# EasyEDA Pro project 【嘉立创】SguanFOC_MOTOR.epro, schematic Schematic1
Board Name: Board1; Create Date: 2026-03-16; Page Name: 电控板; Project Name: ZH-电控板CH32V2(v2.0); Schematic Name: Schematic1; Update Date: 2026-04-14; Company: 星必尘Sguan; Page Size: A3; Version: V1.0
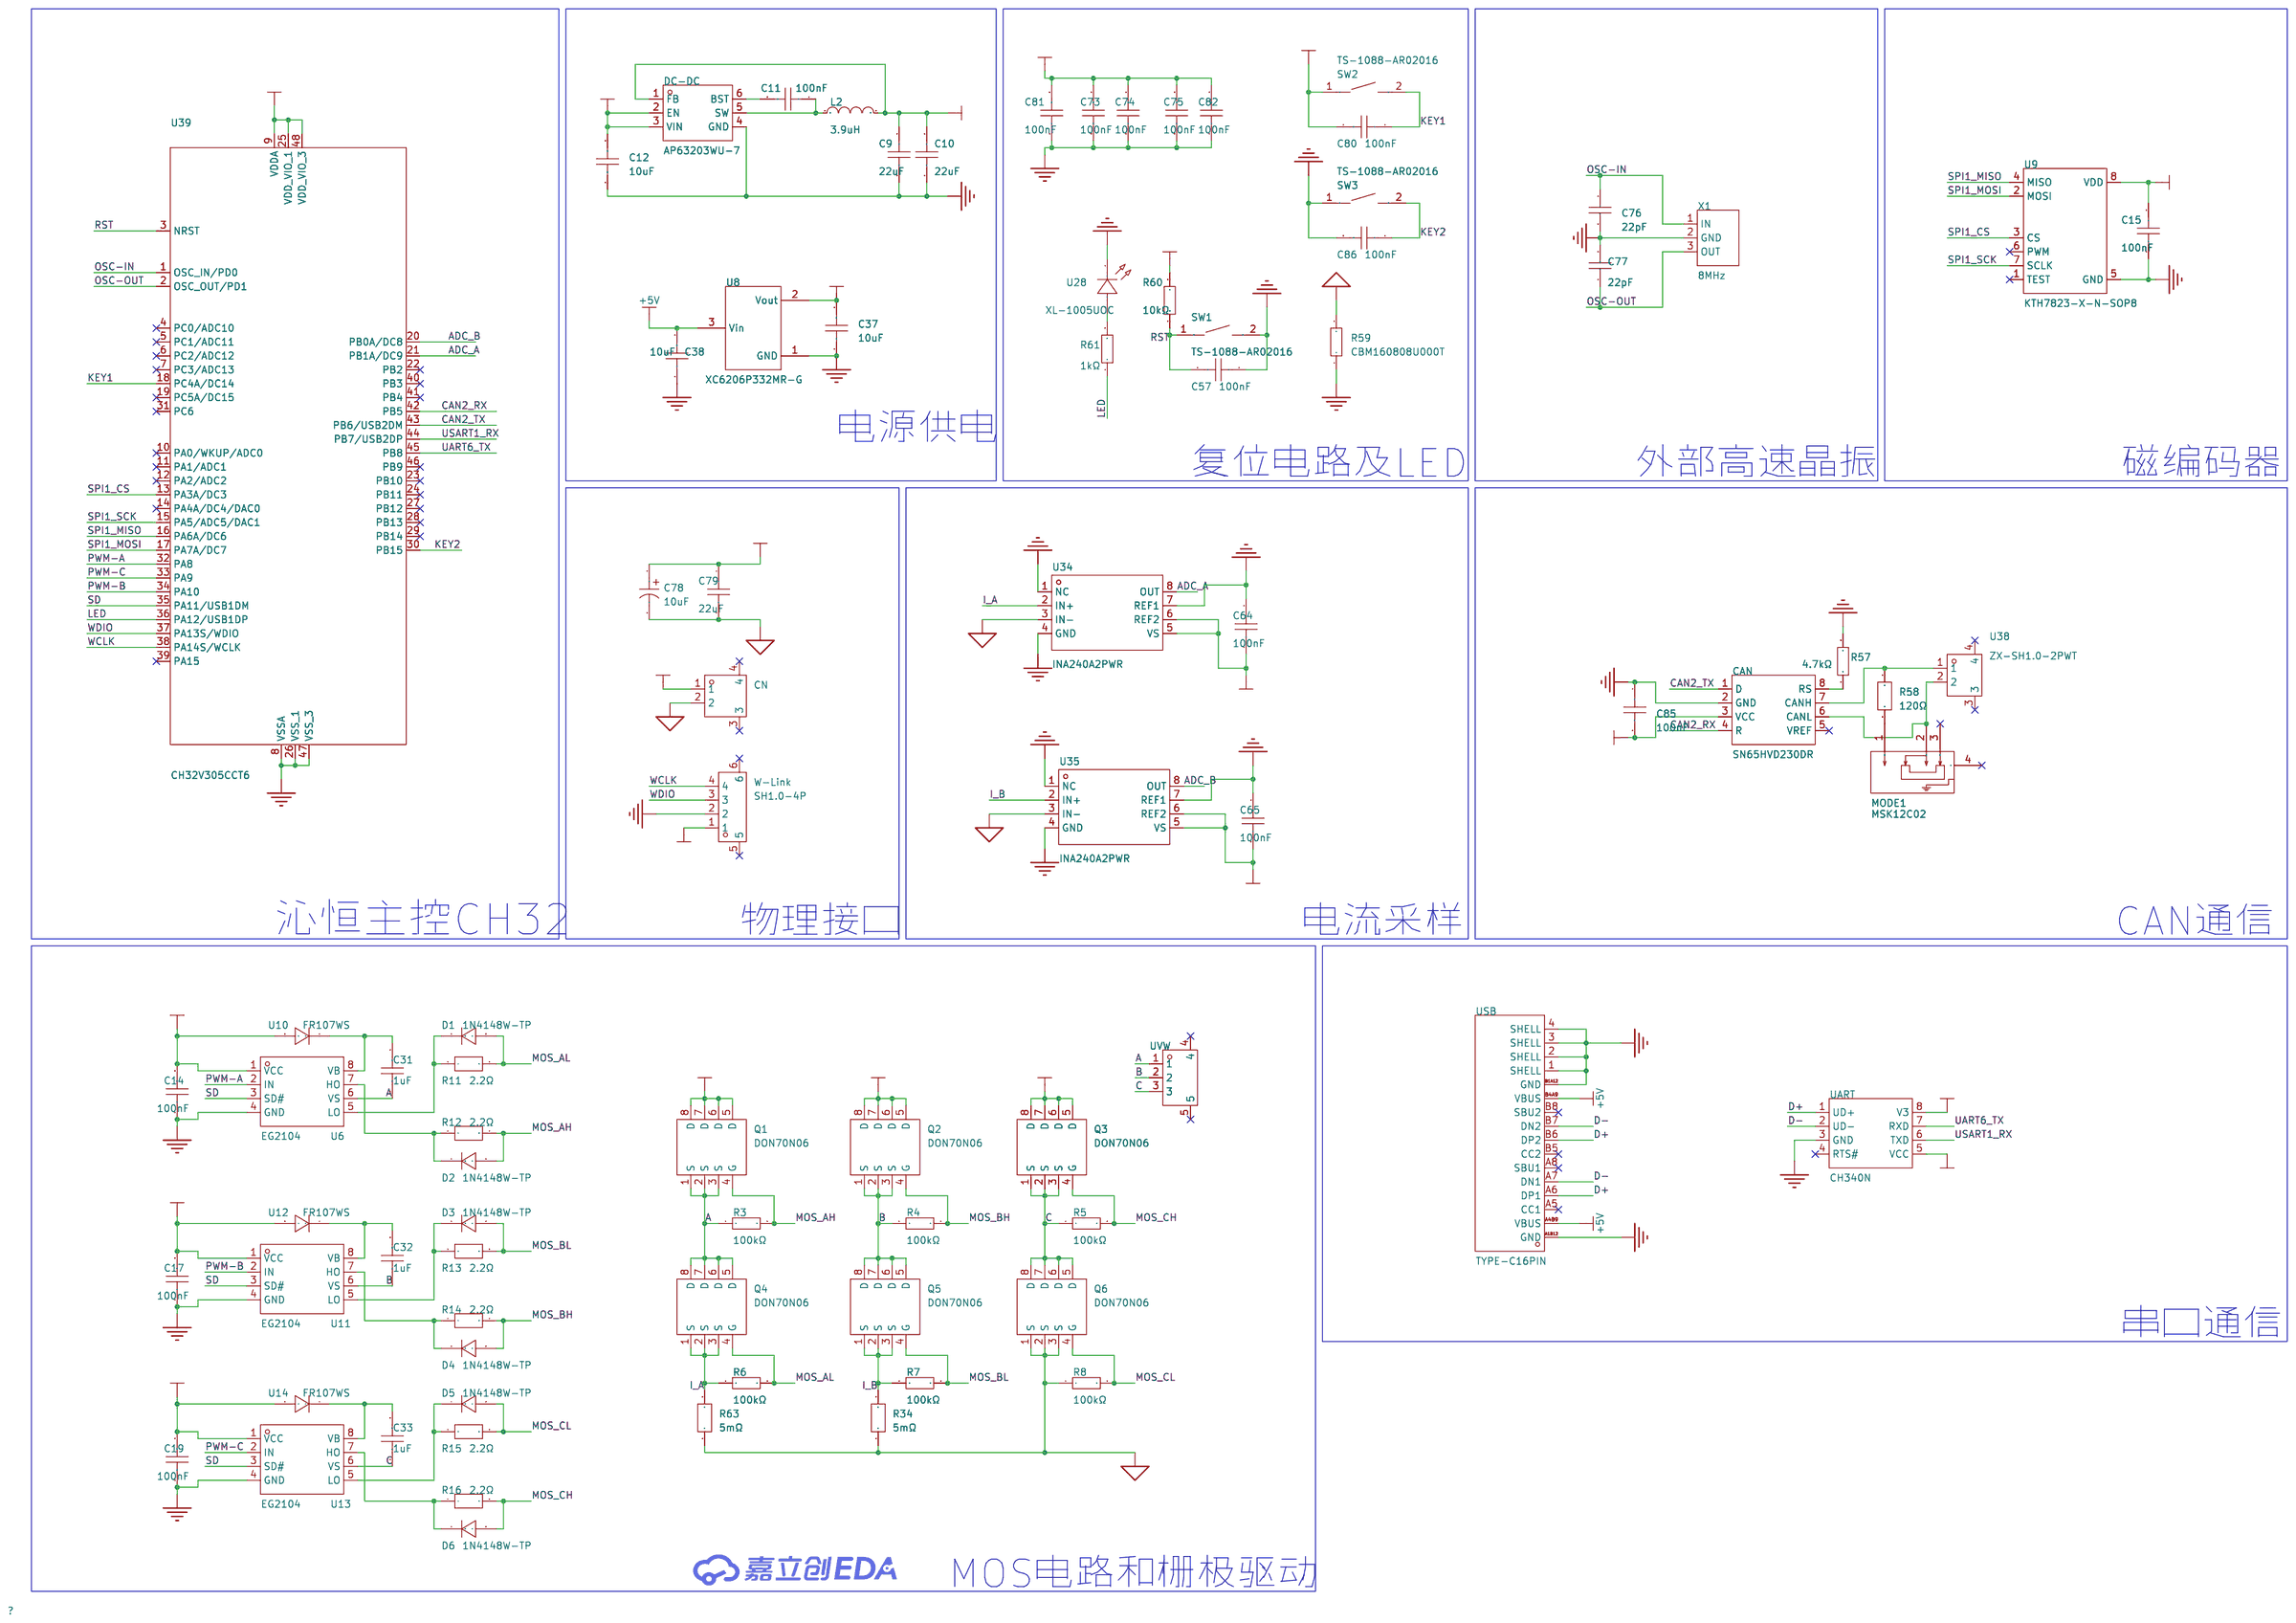
[diagram p0: schematic sheet]

## Parts
C9  22uF  [C0603]
C10  22uF  [C0603]
C11  100nF  [C0603]
C12  10uF  [C0603]
C14  100nF  [C0603]
C15  100nF  [C0603]
C17  100nF  [C0603]
C19  100nF  [C0603]
C31  1uF  [C0603]
C32  1uF  [C0603]
C33  1uF  [C0603]
C37  10uF  [C0603]
C38  10uF  [C0603]
C57  100nF  [C0603]
C64  100nF  [C0603]
C65  100nF  [C0603]
C73  100nF  [C0603]
C74  100nF  [C0603]
C75  100nF  [C0603]
C76  22pF  [C0603]
C77  22pF  [C0603]
C78  10uF  [CAP-SMD_BD4.0-L4.3-W4.3-LS5.0-FD]
C79  22uF  [C0603]
C80  100nF  [C0603]
C81  100nF  [C0603]
C82  100nF  [C0603]
C85  100nF  [C0603]
C86  100nF  [C0603]
CAN  SN65HVD230DR  [SOIC-8_L4.9-W3.9-P1.27-LS6.0-BL]
CN  XT30PW-M  [CONN-TH_XT30PW-M]
D1  1N4148W-TP  [SOD-123_L2.8-W1.8-LS3.7-RD]
D2  1N4148W-TP  [SOD-123_L2.8-W1.8-LS3.7-RD]
D3  1N4148W-TP  [SOD-123_L2.8-W1.8-LS3.7-RD]
D4  1N4148W-TP  [SOD-123_L2.8-W1.8-LS3.7-RD]
D5  1N4148W-TP  [SOD-123_L2.8-W1.8-LS3.7-RD]
D6  1N4148W-TP  [SOD-123_L2.8-W1.8-LS3.7-RD]
DC-DC  AP63203WU-7  [TSOT-26_L2.9-W1.6-P0.95-LS2.8-BL]
L2  3.9uH  [IND-SMD_L3.0-W3.0_FNR30XXS]
MODE1  MSK12C02  [SW-TH_MSK12C02]
Q1  DON70N06  [DFN-8_L5.8-W4.9-P1.27-LS6.1-BL-2]
Q2  DON70N06  [DFN-8_L5.8-W4.9-P1.27-LS6.1-BL-2]
Q3  DON70N06  [DFN-8_L5.8-W4.9-P1.27-LS6.1-BL-2]
Q4  DON70N06  [DFN-8_L5.8-W4.9-P1.27-LS6.1-BL-2]
Q5  DON70N06  [DFN-8_L5.8-W4.9-P1.27-LS6.1-BL-2]
Q6  DON70N06  [DFN-8_L5.8-W4.9-P1.27-LS6.1-BL-2]
R3  100kΩ  [R0603]
R4  100kΩ  [R0603]
R5  100kΩ  [R0603]
R6  100kΩ  [R0603]
R7  100kΩ  [R0603]
R8  100kΩ  [R0603]
R11  2.2Ω  [R1206]
R12  2.2Ω  [R1206]
R13  2.2Ω  [R1206]
R14  2.2Ω  [R1206]
R15  2.2Ω  [R1206]
R16  2.2Ω  [R1206]
R34  5mΩ  [R2512]
R57  4.7kΩ  [R0603]
R58  120Ω  [R0603]
R59  CBM160808U000T  [L0603]
R60  10kΩ  [R0603]
R61  1kΩ  [R0603]
R63  5mΩ  [R2512]
SW1  TS-1088-AR02016  [SW-SMD_L3.9-W3.0-P4.45]
SW2  TS-1088-AR02016  [SW-SMD_L3.9-W3.0-P4.45]
SW3  TS-1088-AR02016  [SW-SMD_L3.9-W3.0-P4.45]
U6  EG2104  [SOP-8_L5.0-W4.0-P1.27-LS6.2-BL]
U8  XC6206P332MR-G  [SOT-23-3_L2.9-W1.6-P1.90-LS2.8-BR]
U9  KTH7823-X-N-SOP8  [SOP-8_L4.9-W3.9-P1.27-LS6.0-BL]
U10  FR107WS  [SOD-323_L1.6-W1.3-LS2.7-RD]
U11  EG2104  [SOP-8_L5.0-W4.0-P1.27-LS6.2-BL]
U12  FR107WS  [SOD-323_L1.6-W1.3-LS2.7-RD]
U13  EG2104  [SOP-8_L5.0-W4.0-P1.27-LS6.2-BL]
U14  FR107WS  [SOD-323_L1.6-W1.3-LS2.7-RD]
U28  XL-1005UOC  [LED0402-RD_ORANGE]
U34  INA240A2PWR  [TSSOP-8_L4.4-W3.0-P0.65-LS6.4-BL]
U35  INA240A2PWR  [TSSOP-8_L4.4-W3.0-P0.65-LS6.4-BL]
U38  ZX-SH1.0-2PWT  [CONN-SMD_2P-P1.00_HX-1.0-2P-WT]
U39  CH32V305CCT6  [LQFP-48_L7.0-W7.0-P0.50-LS9.0-BL_1]
UART  CH340N  [SOP-8_L4.9-W3.9-P1.27-LS6.0-BL]
USB  TYPE-C16PIN  [USB-C-SMD_TYPE-C16PIN]
UVW  MR30PW-F  [CONN-TH_MR30PW-F]
W-Link  SH1.0-4P  [CONN-SMD_4P-P1.00_SH1.0-4P]
X1  8MHz  [OSC-SMD_3P-L3.2-W1.3-P1.20]

## Library data of the parts
C9 C10 C79 = CGA0603X5R226M100JT: 容值:22uF;精度:±20%;额定电压:10V;温度系数:X5R;; LCSC Part Name: 22uF ±20% 10V; Supplier Part: C6119863; Manufacturer: HRE(芯声); Supplier Footprint: 0603; Datasheet: https://item.szlcsc.com/datasheet/CGA0603X5R226M100JT/7062569.html; Supplier: LCSC; Tolerance: ±20%; Voltage Rating: 10V; Temperature Coefficient: X5R
C11 C14 C15 C17 C19 C57 C64 C65 C73-C75 C80-C82 C85 C86 = CGA0603X7R104K500JT: 容值:100nF;精度:±10%;额定电压:50V;温度系数:X7R;; LCSC Part Name: 100nF ±10% 50V; Supplier Part: C6119867; Manufacturer: HRE(芯声); Supplier Footprint: 0603; Datasheet: https://atta.szlcsc.com/upload/public/pdf/source/20250103/C44077DA9E7B3EFAE02F22B6D3D1CBC9.pdf; Supplier: LCSC; Tolerance: ±10%; Voltage Rating: 50V; Temperature Coefficient: X7R
C12 = CGA0603X5R106K100JT: 容值:10uF;精度:±10%;额定电压:10V;温度系数:X5R;; LCSC Part Name: 10uF ±10% 10V; Supplier Part: C6119842; Manufacturer: HRE(芯声); Supplier Footprint: 0603; Supplier: LCSC; Tolerance: ±10%; Voltage Rating: 10V; Temperature Coefficient: X5R
C31-C33 = CGA0603X5R105K500JT: 容值:1uF;精度:±10%;额定电压:50V;温度系数:X5R;; LCSC Part Name: 1uF ±10% 50V; Supplier Part: C6119852; Manufacturer: HRE(芯声); Supplier Footprint: 0603; Supplier: LCSC; Tolerance: ±10%; Voltage Rating: 50V; Temperature Coefficient: X5R
C37 C38 = CAP_0603: Supplier Footprint: 0603
C76 C77 = CL10C220JB8NNNC: 容值:22pF;精度:±5%;额定电压:50V;温度系数:C0G;; LCSC Part Name: 22pF ±5% 50V; Supplier Part: C1653; Manufacturer: SAMSUNG(三星); Supplier Footprint: 0603; JLCPCB Part Class: 基础库; Datasheet: https://item.szlcsc.com/datasheet/CL10C220JB8NNNC/2005.html; Supplier: LCSC; Tolerance: ±5%; Voltage Rating: 50V; Temperature Coefficient: C0G
C78 = RVT16V10M4X5: 容值:10uF;精度:±20%;额定电压:16V;纹波电流:17mA@120Hz;等效串联电阻(ESR):-;; LCSC Part Name: 10uF ±20% 16V; Supplier Part: C47023101; Manufacturer: JIERR(捷而瑞); Supplier Footprint: SMD,D4xL5.4mm; JLCPCB Part Class: Extended Part; Datasheet: https://item.szlcsc.com/datasheet/RVT16V10M4X5/49206202.html; Supplier: LCSC; Tolerance: ±20%; Voltage Rating: 16V; Ripple Current: 17mA@120Hz; Diameter: 4mm; Height - Seated (Max): 5.4mm; Lifetime: 2000hrs@105℃; Operating Temperature: -40℃~+105℃
CAN = SN65HVD230DR: 类型:CAN收发器;数据速率:1Mbps;; LCSC Part Name: 3.3-V CAN 收发器; Supplier Part: C12084; Manufacturer: TI(德州仪器); Supplier Footprint: SOIC-8; JLCPCB Part Class: 扩展库; Datasheet: https://www.ti.com/cn/lit/gpn/sn65hvd230; Supplier: LCSC; Type: CAN收发器; Data Rate: 1Mbps; Operating Temperature: -40℃~+85℃
CN = XT30PW-M: Socket,DCsupply,XT30,male,PIN:2; LCSC Part Name: AMASS(艾迈斯)航模插头 卧式弯脚 XT30PW-M公头; Supplier Part: C431092; Manufacturer: AMASS(艾迈斯); JLCPCB Part Class: 扩展库; Datasheet: https://atta.szlcsc.com/upload/public/pdf/source/20220222/6A9F22F7850E25B33E1BE430ADF8560B.pdf; Supplier: LCSC
D1-D6 = 1N4148W-TP: 二极管配置:-;正向压降(Vf):1.25V@150mA;直流反向耐压(Vr):100V;整流电流:150mA;反向恢复时间(Trr):4ns;; Supplier Part: C77978; Manufacturer: MCC(美微科); Supplier Footprint: SOD-123; JLCPCB Part Class: 扩展库; Datasheet: https://item.szlcsc.com/datasheet/1N4148W-TP/79112.html; Supplier: LCSC; Voltage - Forward(Vf@If): 1.25V@150mA; Voltage - DC Reverse(Vr): 100V; Current - Rectified: 150mA; Pd - Power Dissipation: 400mW; Reverse Leakage Current (Ir): 1uA@75V; Reverse Recovery Time (trr): 4ns; Operating Junction Temperature Range: -65℃~+150℃@(Tj); Non-Repetitive Peak Forward Surge Current: 2A
DC-DC = AP63203WU-7: 功能类型:降压型;工作电压:3.8V~32V;输出电压:3.3V;输出电流:2A;输出类型:固定;; LCSC Part Name: 3.8V至32V输入、2A低静态电流同步降压转换器，增强EMI抑制; Supplier Part: C780769; Manufacturer: DIODES(美台); Supplier Footprint: TSOT-23-6; JLCPCB Part Class: 扩展库; Datasheet: https://item.szlcsc.com/datasheet/AP63203WU-7/832852.html; Supplier: LCSC; Function: 降压型; Voltage - Supply: 3.8V~32V; Output Voltage: 3.3V; Output Current: 2A; Frequency - Switching: 1.1MHz; Operating Temperature: -40℃~+85℃@(TA); Synchronous Rectifier: 是; Number of Outputs: 1; Topology: 降压式; Quiescent Current: 22uA; Switch tube (built-in/external): 内置; Output Type: 固定
L2 = FNR3015S3R9MT: 电感值:3.9uH;精度:±20%;额定电流:1.5A;饱和电流(Isat):1.4A;类型:磁胶屏蔽绕线合金电感;; LCSC Part Name: 3.9uH ±20% 1.4A; Supplier Part: C167751; Manufacturer: cjiang(长江微电); Supplier Footprint: SMD,3x3mm; JLCPCB Part Class: 扩展库; Datasheet: https://atta.szlcsc.com/upload/public/pdf/source/20190327/C167925_9EFF0AABC4CA629C2CC95961DBF7D39D.pdf; Supplier: LCSC; Tolerance: ±20%; Current Rating: 1.5A; Current - Saturation(Isat): 1.4A; DC Resistance(DCR): 137mΩ; Type: 磁胶屏蔽绕线合金电感
MODE1 = MSK12C02: 电路结构:单刀双掷;安装方式:卧贴;开关颜色:-;额定电流(DC):50mA;额定电压(DC):12V;额定电流(AC):-;额定电压(AC):-;机械寿命:1万次;; LCSC Part Name: 两档侧拨贴片 7脚 滑动开关; Supplier Part: C431540; Manufacturer: SHOU HAN(首韩); Supplier Footprint: SMD; Datasheet: https://atta.szlcsc.com/upload/public/pdf/source/20190925/C431540_89155AEF0758B9AD1B2D805F83FB12E3.pdf; Supplier: LCSC; Circuit: 单刀双掷; Pin Style: SMD接片; Switch Length: 8mm; Switch Width: 2.8mm; Switch Height: 1.4mm; Mounting Style: 卧贴; Current Rating (DC): 50mA; Voltage Rating (DC): 12V; Mechanical Life: 1万次; Operating Temperature: -20℃~+70℃
Q1-Q6 = DON70N06: 数量:1个N沟道;漏源电压(Vdss):60V;连续漏极电流(Id):70A;导通电阻(RDS(on)):6mΩ@10V;耗散功率(Pd):87W;阈值电压(Vgs(th)):2.5V@250uA;; Supplier Part: C41384263; Manufacturer: DOINGTER(杜因特); Supplier Footprint: DFN5x6-8; JLCPCB Part Class: 扩展库; Datasheet: https://item.szlcsc.com/datasheet/DON70N06/43175967.html; Supplier: LCSC; Number: 1个N沟道; Drain to Source Voltage: 60V; Current - Continuous Drain(Id): 70A; RDS(on): 6mΩ@10V; Pd - Power Dissipation: 87W; Gate Threshold Voltage (Vgs(th)): 2.5V@250uA; Gate Charge(Qg): 30nC@10V; Input Capacitance(Ciss): 2.136nF@50V; Reverse Transfer Capacitance (Crss@Vds): 10.6pF@50V; Operating Temperature: -55℃~+150℃; Type: N沟道
R3-R8 = 0603WAF1003T5E: 电阻类型:厚膜电阻;阻值:100kΩ;精度:±1%;功率:100mW;工作电压:75V;温度系数:±100ppm/℃;; LCSC Part Name: 100kΩ ±1% 100mW 厚膜电阻; Supplier Part: C25803; Manufacturer: UNI-ROYAL(厚声); Supplier Footprint: 0603; JLCPCB Part Class: 基础库; Datasheet: https://item.szlcsc.com/datasheet/0603WAF1003T5E/26546.html; Supplier: LCSC; Type: 厚膜电阻; Tolerance: ±1%; Power(Watts): 100mW; Voltage-Supply(Max): 75V; Temperature Coefficient: ±100ppm/℃; Operating Temperature: -55℃~+155℃
R11-R16 = FRC1206J2R2 TS: 电阻类型:厚膜电阻;阻值:2.2Ω;精度:±5%;功率:250mW;工作电压:200V;温度系数:±200ppm/℃;; LCSC Part Name: 2.2Ω ±5% 250mW 厚膜电阻; Supplier Part: C2907445; Manufacturer: FOJAN(富捷); Supplier Footprint: 1206; JLCPCB Part Class: 扩展库; Supplier: LCSC; Type: 厚膜电阻; Tolerance: ±5%; Power(Watts): 250mW; Voltage-Supply(Max): 200V; Temperature Coefficient: ±200ppm/℃; Operating Temperature: -55℃~+155℃
R34 R63 = JER2512F3R005: 电阻类型:采样电阻；合金电阻;阻值:5mΩ;精度:±1%;功率:3W;温度系数:±50ppm/℃;; LCSC Part Name: 5mΩ 3W 2512 ±1%; Supplier Part: C46634460; Manufacturer: JIERR(捷而瑞); Supplier Footprint: 2512; JLCPCB Part Class: 扩展库; Datasheet: https://item.szlcsc.com/datasheet/JER2512F3R005/48788262.html; Supplier: LCSC; Type: 采样电阻；合金电阻; Tolerance: ±1%; Power(Watts): 3W; Temperature Coefficient: ±50ppm/℃
R57 = 0603WAF4701T5E: 电阻类型:厚膜电阻;阻值:4.7kΩ;精度:±1%;功率:100mW;工作电压:75V;温度系数:±100ppm/℃;; LCSC Part Name: 4.7kΩ ±1% 100mW 厚膜电阻; Supplier Part: C23162; Manufacturer: UNI-ROYAL(厚声); Supplier Footprint: 0603; Datasheet: https://item.szlcsc.com/datasheet/0603WAF4701T5E/23889.html; Supplier: LCSC; Type: 厚膜电阻; Tolerance: ±1%; Power(Watts): 100mW; Voltage-Supply(Max): 75V; Temperature Coefficient: ±100ppm/℃; Operating Temperature: -55℃~+155℃
R58 = FRC0603J121 TS: 电阻类型:厚膜电阻;阻值:120Ω;精度:±5%;功率:100mW;工作电压:75V;温度系数:±100ppm/℃;; LCSC Part Name: 120Ω ±5% 100mW 厚膜电阻; Supplier Part: C2907096; Manufacturer: FOJAN(富捷); Supplier Footprint: 0603; JLCPCB Part Class: 扩展库; Supplier: LCSC; Type: 厚膜电阻; Tolerance: ±5%; Power(Watts): 100mW; Voltage-Supply(Max): 75V; Temperature Coefficient: ±100ppm/℃; Operating Temperature: -55℃~+155℃
R59 = CBM160808U000T: 阻抗@频率:0Ω@100MHz;直流电阻(DCR):10mΩ;; LCSC Part Name: 单路 0603磁珠 阻抗0Ω@100MHz; Supplier Part: C394410; Manufacturer: FH(风华); Supplier Footprint: 0603; JLCPCB Part Class: Extended Part; Datasheet: https://item.szlcsc.com/datasheet/CBM160808U000T/373685.html; Supplier: LCSC; Impedance @ Frequency: 0Ω@100MHz; DC Resistance(DCR): 10mΩ; Current Rating: 6A; Number of Circuits: 1; Operating Temperature: -55℃~+125℃
R60 = 0603WAF1002T5E: 电阻类型:厚膜电阻;阻值:10kΩ;精度:±1%;功率:100mW;工作电压:75V;温度系数:±100ppm/℃;; LCSC Part Name: 厚膜电阻 10kΩ ±1% 100mW; Supplier Part: C25804; Manufacturer: UNI-ROYAL(厚声); Supplier Footprint: 0603; Datasheet: https://item.szlcsc.com/datasheet/0603WAF1002T5E/26547.html; Supplier: LCSC; Type: 厚膜电阻; Tolerance: ±1%; Power(Watts): 100mW; Voltage-Supply(Max): 75V; Temperature Coefficient: ±100ppm/℃; Operating Temperature: -55℃~+155℃
R61 = 0603WAF1001T5E: 电阻类型:厚膜电阻;阻值:1kΩ;精度:±1%;功率:100mW;工作电压:75V;温度系数:±100ppm/℃;; LCSC Part Name: 1kΩ ±1% 100mW 厚膜电阻; Supplier Part: C21190; Manufacturer: UNI-ROYAL(厚声); Supplier Footprint: 0603; Datasheet: https://item.szlcsc.com/datasheet/0603WAF1001T5E/21904.html; Supplier: LCSC; Type: 厚膜电阻; Tolerance: ±1%; Power(Watts): 100mW; Voltage-Supply(Max): 75V; Temperature Coefficient: ±100ppm/℃; Operating Temperature: -55℃~+155℃
SW1-SW3 = TS-1088-AR02016: 电路结构:单刀单掷;按钮形状:圆形按钮;作用力:1.6N;安装方式:立贴;开关长度:4mm;开关宽度:3mm;开关高度:2mm;带支架:不带支架;触点电流:50mA;额定电压:12V;工作寿命:10万次;; LCSC Part Name: 4*3*2mm 立贴 轻触开关; Supplier Part: C720477; Manufacturer: XUNPU(讯普); Supplier Footprint: SMD,4x3mm; Datasheet: https://item.szlcsc.com/datasheet/TS-1088-AR02016/763484.html; Supplier: LCSC; Circuit: 单刀单掷; Actuator Style: 圆形按钮; Operating Force: 1.6N; Mounting Type: 立贴; Length: 4mm; Width: 3mm; Switch Height: 2mm; with Bracket: 不带支架; Contact Current: 50mA; Voltage Rating: 12V; Actuator/Cap Color: 黑色; Termination Style: SMD接片; Life: 10万次; Operating Temperature: -30℃~+80℃
U6 U11 U13 = EG2104: 高性价比, 600V，半桥式Nmos预驱动器; Supplier Part: C186697; Manufacturer: EG(屹晶微); Supplier Footprint: SOP-8; JLCPCB Part Class: 扩展库; Datasheet: https://atta.szlcsc.com/upload/public/pdf/source/20220627/4CCFA0CAB664067FEE4AF87E4129127F.pdf; Supplier: LCSC
U8 = XC6206P332MR-G_C5446: 输出类型:固定;工作电压:6V;输出电压:3.3V;输出电流:200mA;电源纹波抑制比(PSRR):-;输出极性:正极;; LCSC Part Name: 输入6V 输出3.3V 200mA; Supplier Part: C5446; Manufacturer: TOREX(特瑞仕); Supplier Footprint: SOT-23-3L; Datasheet: https://item.szlcsc.com/datasheet/XC6206P332MR-G/5896.html; Supplier: LCSC; Output Type: 固定; Voltage - Supply: 6V; Output Voltage: 3.3V; Output Current: 200mA; standby current: 1uA; Features: 过流保护; Operating Temperature: -40℃~+85℃@(Ta); Output Configuration: 正极; Number of Outputs: 1
U9 = KTH7823-X-N-SOP8: Supplier Part: C49257202; Manufacturer: CONNTEK(昆泰芯); Supplier Footprint: SOP-8; JLCPCB Part Class: 扩展库; Datasheet: https://item.szlcsc.com/datasheet/KTH7823-X-N-SOP8/51694844.html; Supplier: LCSC
U10 U12 U14 = FR107WS: 二极管配置:独立式;正向压降(Vf):1.3V@1A;直流反向耐压(Vr):1kV;整流电流:1A;反向恢复时间(Trr):500ns;; LCSC Part Name: 耐压:1kV 电流:1A 反向恢复时间：500ns; Supplier Part: C964087; Manufacturer: MDD(辰达半导体); Supplier Footprint: SOD-323; JLCPCB Part Class: 扩展库; Datasheet: https://item.szlcsc.com/datasheet/FR107WS/1048636.html; Supplier: LCSC; Diode Configuration: 独立式; Voltage - Forward(Vf@If): 1.3V@1A; Voltage - DC Reverse(Vr): 1kV; Current - Rectified: 1A; Reverse Leakage Current (Ir): 5uA@1kV; Reverse Recovery Time (trr): 500ns; Operating Junction Temperature Range: -55℃~+125℃@(Tj); Non-Repetitive Peak Forward Surge Current: 15A
U28 = XL-1005UOC: 发光颜色:橙色;正向压降(Vf):2.3V;功率:50mW;正向电流:20mA;波长:600nm~610nm;透镜颜色:无色透明透镜;色温:-;发光强度:350mcd;发光角度:120°;载带方式:正贴;工作温度:-40℃~+85℃;; LCSC Part Name: 0402橙贴片式发光二极管; Supplier Part: C965791; Manufacturer: XINGLIGHT(成兴光); Supplier Footprint: 0402; JLCPCB Part Class: 扩展库; Datasheet: https://item.szlcsc.com/datasheet/XL-1005UOC/1051400.html; Supplier: LCSC; Illumination Color: 橙色; Voltage - Forward(Vf): 2.3V; Power(Watts): 50mW; Forward Current: 20mA; Wavelength - Dominant: 600nm~610nm; Peak Wavelength: 605nm; Lens Color: 无色透明透镜; Luminous Intensity: 350mcd; Viewing Angle: 120°; Mounting Style: 正贴; Operating Temperature: -40℃~+85℃
U34 U35 = INA240A2PWR: 放大器数:单路;共模电压:-4V~80V;增益:50V/V;带宽:400kHz;; LCSC Part Name: 具有增强型PWM抑制功能的高侧和低侧双向零漂移电流感测放大器; Supplier Part: C129949; Manufacturer: TI(德州仪器); Supplier Footprint: TSSOP-8; JLCPCB Part Class: 扩展库; Datasheet: https://www.ti.com/cn/lit/gpn/ina240; Supplier: LCSC; Number of Channels: 单路; Vcm - Common Mode Voltage: -4V~80V; Gain: 50V/V; Bandwidth: 400kHz; Ib - Input Bias Current: 90uA; Vos - Input Offset Voltage: 5uV; Operating Temperature: -40℃~+125℃; Differential Voltage: -80V~+80V; Single Supply: 2.7V~5.5V; Quiescent Current: 1.8mA; Input Offset Voltage Drift(Vos TC): 250nV/℃; Slew Rate: 2V/us; Common Mode Rejection Ratio (CMRR): 132dB; Noise density(eN): 40nV/√Hz@1kHz
U38 = ZX-SH1.0-2PWT: 插针结构:1x2P;间距:1mm;安装方式:卧贴;参考系列:SH;总PIN数:2P;排数:1;每排PIN数:2;行距:-;额定电流:1A;触头材质:黄铜;触头镀层:锡;工作温度:-40℃~+85℃;; LCSC Part Name: 1x2P 间距:1mm 卧贴 系列:SH; Supplier Part: C7430444; Manufacturer: Megastar(兆星); Supplier Footprint: SMD,P=1mm,卧贴; JLCPCB Part Class: 扩展库; Datasheet: https://item.szlcsc.com/datasheet/ZX-SH1.0-2PWT/8430313.html; Supplier: LCSC; Pins Structure: 1x2P; Pitch: 1mm; Mounting Type: 卧贴; Reference Series: SH; Number of Pins: 2P; Number of Rows: 1; Number of PINs Per Row: 2; Current Rating: 1A; Contact Material: 黄铜; Contact Plating: 锡; Operating Temperature: -40℃~+85℃; Voltage Rating: 50V; Plastic Material: LCP; Supplementary Features: 辅助焊脚; Color: 米色; Z-Height of the Board: 3.15mm; X-Length of Bottom Edge on Board (Spacing Line): 4.35mm; Y-Width of Bottom Edge on Board: 4.3mm
U39 = CH32V305CCT6: Supplier Part: C9900190281; Supplier Footprint: LQFP48; Supplier: LCSC
UART = CH340N: 应用功能:USB转串口;接口协议:USB 2.0;通道数:1;数据速率:2Mbps;; LCSC Part Name: USB2.0芯片CH340; Supplier Part: C2977777; Manufacturer: WCH(南京沁恒); Supplier Footprint: SOP-8; JLCPCB Part Class: 扩展库; Datasheet: https://atta.szlcsc.com/upload/public/pdf/source/20240313/115CDE92081B1D6CB446704AD5D0F5F2.pdf; Supplier: LCSC; Applications Function: USB转串口; Protocol: USB 2.0; Number of Channels: 1; Voltage - Supply: 3.3V；5V; Data Rate: 2Mbps; Operating Temperature: -20℃~+70℃
USB = TYPE-C16PIN: 连接器类型:Type-C;协议标准:USB 3.1;公母:母;安装方式:卧贴;触点数量:16P;端口数量:1;额定电流 - 电源:3A;工作温度:-40℃~+85℃;; LCSC Part Name: Type-C 母 卧贴; Supplier Part: C393939; Manufacturer: SHOU HAN(首韩); Supplier Footprint: SMD; JLCPCB Part Class: 扩展库; Datasheet: https://item.szlcsc.com/datasheet/TYPE-C16PIN/372551.html; Supplier: LCSC; Connector Type: Type-C; Protocol Standard: USB 3.1; Gender: 母; Mounting Type: 卧贴; Number of Contacts: 16P; Number of Ports: 1; Current Rating-Power: 3A; Voltage Rating: 30V; Connect-Disconnect Life: 1万次; Detection color: 黑色; Operating Temperature: -40℃~+85℃
UVW = MR30PW-F: Supplier Part: C2928110; Supplier Footprint: Through hole; JLCPCB Part Class: 扩展库; Supplier: LCSC
W-Link = SH1.0-4P: Supplier Part: C9900023784; Supplier Footprint: CONN-SMD-4P; JLCPCB Part Class: 扩展库; Supplier: LCSC
X1 = CSTNE8M00G520000R0: 频率:8MHz;内置负载电容:10pF;谐振阻抗:40Ω;; LCSC Part Name: 8MHz ±0.5% 内置负载电容:10pF; Supplier Part: C907975; Manufacturer: muRata(村田); Supplier Footprint: SMD3213-3P; JLCPCB Part Class: 扩展库; Datasheet: https://item.szlcsc.com/datasheet/CSTNE8M00G520000R0/973876.html; Supplier: LCSC; Built - in Load Capacitance: 10pF; Resonant Impedance: 40Ω; Operating Temperature: -40℃~+85℃

## Nets
+3.3V: C9.1 C10.1 C15.2 C37.2 C64.1 C65.1 C73.2 C74.2 C75.2 C80.2 C81.2 C82.2 C85.2 CAN.3(VCC) DC-DC.1(FB) L2.2 R60.1 SW2.1 U8.2(Vout) U9.8(VDD) U34.5(VS) U34.6(REF2) U35.5(VS) U35.6(REF2) U39.9(VDDA) U39.25(VDD_VIO_1) U39.48(VDD_VIO_3) UART.5(VCC) UART.8(V3) W-Link.1
+5V: C38.2 U8.3(Vin) USB.A4B9(VBUS) USB.B4A9(VBUS)
+12V: C12.1 C14.2 C17.2 C19.2 C78.1 C79.1 CN.1 DC-DC.2(EN) DC-DC.3(VIN) Q1.5(D) Q1.6(D) Q1.7(D) Q1.8(D) Q2.5(D) Q2.6(D) Q2.7(D) Q2.8(D) Q3.5(D) Q3.6(D) Q3.7(D) Q3.8(D) U6.1(VCC) U10.2(A) U11.1(VCC) U12.2(A) U13.1(VCC) U14.2(A)
AGND: C78.2 C79.2 CN.2 Q6.1(S) Q6.2(S) Q6.3(S) R8.1 R34.1 R59.2 R63.1 U34.3(IN-) U35.3(IN-)
GND: C9.2 C10.2 C12.2 C14.1 C15.1 C17.1 C19.1 C37.1 C38.1 C57.1 C64.2 C65.2 C73.1 C74.1 C75.1 C76.2 C77.2 C81.1 C82.1 C85.1 C86.2 CAN.2(GND) DC-DC.4(GND) R57.2 R59.1 SW1.2 SW3.1 U6.4(GND) U8.1(GND) U9.5(GND) U11.4(GND) U13.4(GND) U28.1(K) U34.1(NC) U34.4(GND) U34.7(REF1) U35.1(NC) U35.4(GND) U35.7(REF1) U39.8(VSSA) U39.26(VSS_1) U39.47(VSS_3) UART.3(GND) USB.1(SHELL) USB.2(SHELL) USB.3(SHELL) USB.4(SHELL) USB.A1B12(GND) USB.B1A12(GND) W-Link.2 X1.2(GND)
A: C31.1 Q1.1(S) Q1.2(S) Q1.3(S) Q4.5(D) Q4.6(D) Q4.7(D) Q4.8(D) R3.1 U6.6(VS) UVW.1
ADC_A: U34.8(OUT) U39.21(PB1A/DC9)
ADC_B: U35.8(OUT) U39.20(PB0A/DC8)
B: C32.1 Q2.1(S) Q2.2(S) Q2.3(S) Q5.5(D) Q5.6(D) Q5.7(D) Q5.8(D) R4.1 U11.6(VS) UVW.2
C: C33.1 Q3.1(S) Q3.2(S) Q3.3(S) Q6.5(D) Q6.6(D) Q6.7(D) Q6.8(D) R5.1 U13.6(VS) UVW.3
CAN2_RX: CAN.4(R) U39.42(PB5)
CAN2_TX: CAN.1(D) U39.43(PB6/USB2DM)
D+: UART.1(UD+) USB.A6(DP1) USB.B6(DP2)
D-: UART.2(UD-) USB.A7(DN1) USB.B7(DN2)
I_A: Q4.1(S) Q4.2(S) Q4.3(S) R6.1 R63.2 U34.2(IN+)
I_B: Q5.1(S) Q5.2(S) Q5.3(S) R7.1 R34.2 U35.2(IN+)
KEY1: C80.1 SW2.2 U39.18(PC4A/DC14)
KEY2: C86.1 SW3.2 U39.30(PB15)
LED: R61.1 U39.36(PA12/USB1DP)
MOS_AH: D2.2(A) Q1.4(G) R3.2 R12.2
MOS_AL: D1.2(A) Q4.4(G) R6.2 R11.2
MOS_BH: D4.2(A) Q2.4(G) R4.2 R14.2
MOS_BL: D3.2(A) Q5.4(G) R7.2 R13.2
MOS_CH: D6.2(A) Q3.4(G) R5.2 R16.2
MOS_CL: D5.2(A) Q6.4(G) R8.2 R15.2
OSC-IN: C76.1 U39.1(OSC_IN/PD0) X1.1(IN)
OSC-OUT: C77.1 U39.2(OSC_OUT/PD1) X1.3(OUT)
PWM-A: U6.2(IN) U39.32(PA8)
PWM-B: U11.2(IN) U39.34(PA10)
PWM-C: U13.2(IN) U39.33(PA9)
RST: C57.2 R60.2 SW1.1 U39.3(NRST)
SD: U6.3(SD#) U11.3(SD#) U13.3(SD#) U39.35(PA11/USB1DM)
SPI1_CS: U9.3(CS) U39.13(PA3A/DC3)
SPI1_MISO: U9.4(MISO) U39.16(PA6A/DC6)
SPI1_MOSI: U9.2(MOSI) U39.17(PA7A/DC7)
SPI1_SCK: U9.7(SCLK) U39.15(PA5/ADC5/DAC1)
UART6_TX: U39.45(PB8) UART.7(RXD)
USART1_RX: U39.44(PB7/USB2DP) UART.6(TXD)
WCLK: U39.38(PA14S/WCLK) W-Link.4
WDIO: U39.37(PA13S/WDIO) W-Link.3
$1N31257: CAN.7(CANH) R58.1 U38.1
$1N31258: CAN.6(CANL) MODE1.2 U38.2
$1N31259: MODE1.1 R58.2
$1N31261: CAN.8(RS) R57.1
$1N36284: R61.2 U28.2(A)
$1N49069: D6.1(c) R16.1 U13.7(HO)
$1N49070: C33.2 U13.8(VB) U14.1(K)
$1N49073: D4.1(c) R14.1 U11.7(HO)
$1N49074: C32.2 U11.8(VB) U12.1(K)
$1N49075: D2.1(c) R12.1 U6.7(HO)
$1N49077: D1.1(c) R11.1 U6.5(LO)
$1N49078: C31.2 U6.8(VB) U10.1(K)
$1N49097: D5.1(c) R15.1 U13.5(LO)
$1N49104: D3.1(c) R13.1 U11.5(LO)
$1N60408: C11.1 DC-DC.5(SW) L2.1
$1N60409: C11.2 DC-DC.6(BST)

Not connected (* = marked no-connect by the designer): CAN 5(VREF)*; CN 3* 4*; MODE1 3* 4*; U9 1(TEST)* 6(PWM)*; U38 3* 4*; U39 4(PC0/ADC10)* 5(PC1/ADC11)* 6(PC2/ADC12)* 7(PC3/ADC13)* 10(PA0/WKUP/ADC0)* 11(PA1/ADC1)* 12(PA2/ADC2)* 14(PA4A/DC4/DAC0)* 19(PC5A/DC15)* 22(PB2)* 23(PB10)* 24(PB11)* 27(PB12)* 28(PB13)* 29(PB14)* 31(PC6)* 39(PA15)* 40(PB3)* 41(PB4)* 46(PB9)*; UART 4(RTS#)*; USB A5(CC1)* A8(SBU1)* B5(CC2)* B8(SBU2)*; UVW 4* 5*; W-Link 5* 6*

## Notes on the sheet
- 电源供电
- 复位电路及LED
- 外部高速晶振
- 磁编码器
- 沁恒主控CH32
- 物理接口
- 电流采样
- CAN通信
- 串口通信
- MOS电路和栅极驱动
